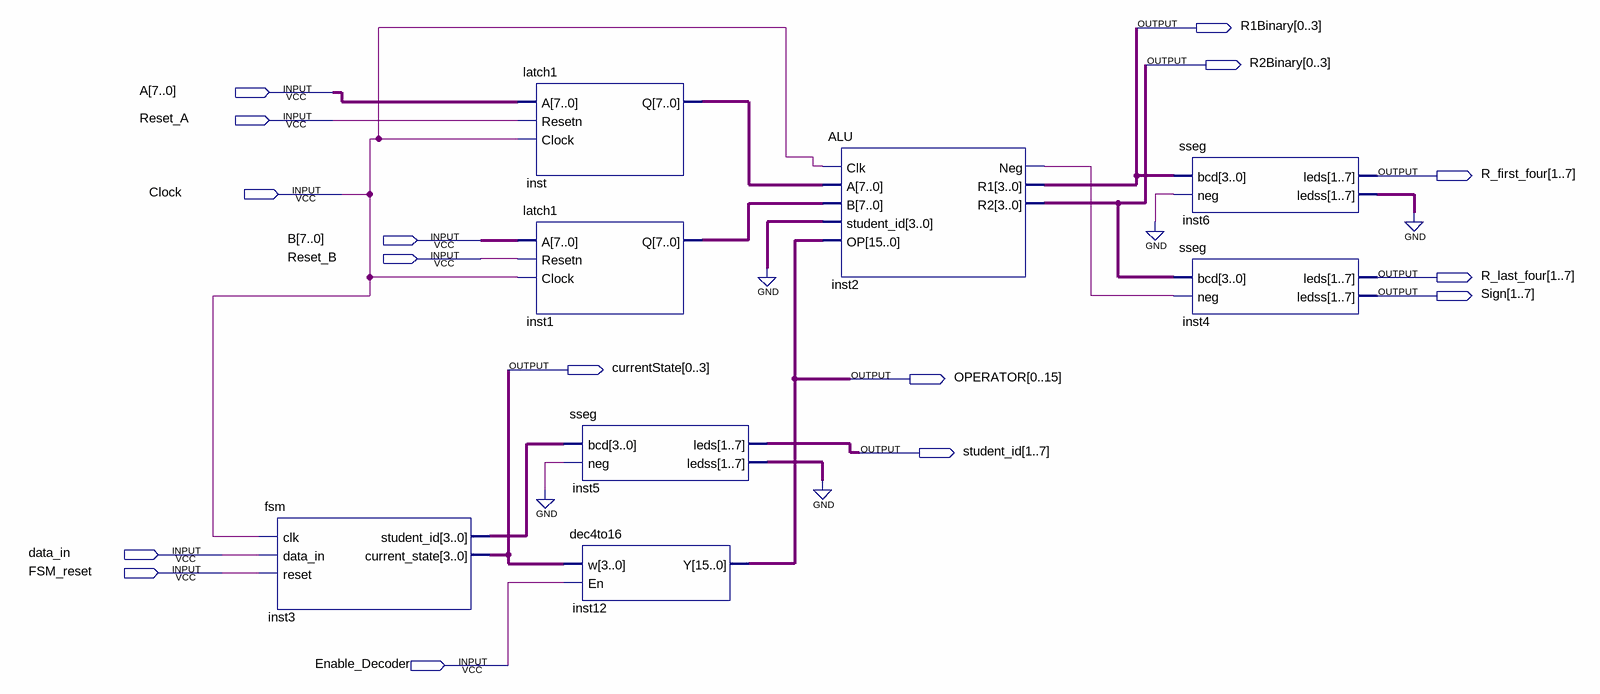
[diagram p0: schematic sheet]
// Quartus schematic lab6.bdf as structural Verilog: 8 symbols, 16 pins
module lab6 (
  input  [7:0] A,
  input  Reset_A,
  input  Clock,
  input  [7:0] B,
  input  Reset_B,
  input  data_in,
  input  FSM_reset,
  input  Enable_Decoder,
  output [0:3] R1Binary,
  output [0:3] R2Binary,
  output [1:7] R_first_four,
  output [1:7] R_last_four,
  output [1:7] Sign,
  output [0:3] currentState,
  output [0:15] OPERATOR,
  output [1:7] student_id
);

  wire inst2_neg;
  wire [3:0] inst3_student_id;
  wire [6:0] inst5_ledss, inst6_ledss;
  wire [7:0] inst1_q, inst_q;

  fsm inst3 (
    .clk(Clock), .data_in(data_in), .reset(FSM_reset), .student_id(inst3_student_id),
    .current_state(currentState));
  latch1 inst (.A(A), .Resetn(Reset_A), .Clock(Clock), .Q(inst_q));
  latch1 inst1 (.A(B), .Resetn(Reset_B), .Clock(Clock), .Q(inst1_q));
  sseg inst5 (.bcd(inst3_student_id), .neg(1'b0), .leds(student_id), .ledss(inst5_ledss));
  dec4to16 inst12 (.w(currentState), .En(Enable_Decoder), .Y(OPERATOR));
  ALU inst2 (
    .Clk(Clock), .A(inst_q), .B(inst1_q), .student_id(4'b0000), .OP(OPERATOR), .Neg(inst2_neg),
    .R1(R1Binary), .R2(R2Binary));
  sseg inst6 (.bcd(R1Binary), .neg(1'b0), .leds(R_first_four), .ledss(inst6_ledss));
  sseg inst4 (.bcd(R2Binary), .neg(inst2_neg), .leds(R_last_four), .ledss(Sign));
  // also tied to GND on the sheet: {inst6_ledss[0], inst6_ledss[1], inst6_ledss[2], inst6_ledss[3], inst6_ledss[4], inst6_ledss[5], inst6_ledss[6], inst5_ledss[0], inst5_ledss[1], inst5_ledss[2], inst5_ledss[3], inst5_ledss[4], inst5_ledss[5], inst5_ledss[6]}
endmodule
